# Altium schematic sheet rev_1.SchDoc
size A
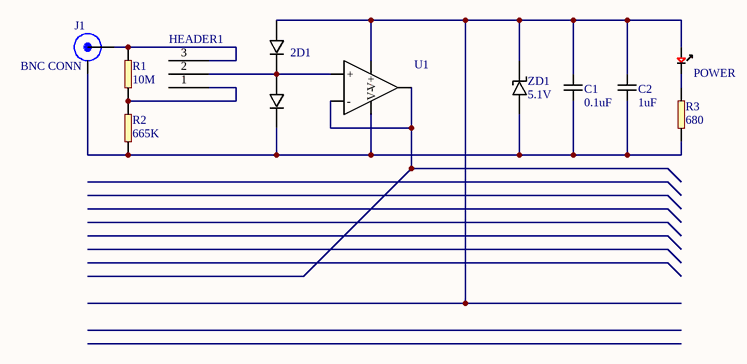
[diagram p0: rev_1.SchDoc]

## Parts
2D1  BAT54SW-FDICT  [SOT-23-3]  (value not drawn)
C1  C: 0.1uF  [0603]  (hidden comment: Capacitor)
C2  C: 1uF  [0603]  (hidden comment: Capacitor)
HEADER1  3x1  [3x1 THRU HOLES 0.1" PITCH]  (value not drawn)
J1  BNC CONN  [BNC THROUGH HOLE]
POWER  LEDR  [0603 - LED]  (value not drawn)
R1  R: 10M  [0603]  (hidden comment: Resistor)
R2  R: 665K  [0603]  (hidden comment: Resistor)
R3  R: 680  [0603]  (hidden comment: Resistor)
U1  MCP6L9IT-E  [SOT-23-5]  (value not drawn)
ZD1  Voltage: 5.1V  (hidden comment: Zener)

## Nets
Net2D1_1: 2D1.1 C1.1 C2.1 POWER.2(A) U1.3(V+) ZD1.1
Net2D1_2: 2D1.2 C1.2 C2.2 J1.1(G) R2.2 R3.2 U1.2(V-) ZD1.2
Net2D1_3: 2D1.3 HEADER1.2 U1.3(+)
NetHEADER1_1: HEADER1.1 R1.2 R2.1
NetHEADER1_3: HEADER1.3 J1.2(S) R1.1
NetPOWER_1: POWER.1(K) R3.1
NetU1_1: U1.1(OUT) U1.4(-)

## Library data of the parts
J1 = A33798
C1 C2 = Capacitor: Supplier 1: Digi-Key; Supplier Part Number 1: 445-9015-6-ND; Supplier Part Number 2: 490-1524-2-ND; Supplier 2: Digi-Key; Supplier 3: Digi-Key; Supplier Part Number 3: 445-1273-1-ND
POWER = LEDR: Supplier 1: Digi-Key; Supplier Part Number 1: 475-2512-1-ND
R1-R3 = Resistor
  R3: Supplier 1: Digi-Key; Supplier Part Number 1: LVK12R020DERDKR-ND; Supplier 2: Digi-Key; Supplier 3: Digi-Key; Supplier Part Number 2: 311-10.0KHRCT-ND; Supplier Part Number 3: 311-100KHRCT-ND; Supplier 4: Digi-Key; Supplier Part Number 4: RHM0.0GCT-ND; Supplier 5: Digi-Key; Supplier 6: Digi-Key; Supplier Part Number 5: 311-200KHRCT-ND; Supplier Part Number 6: LVK12R010DERCT-ND; Supplier 7: Digi-Key; Supplier 8: Digi-Key; Supplier Part Number 7: 311-300KHRCT-ND; Supplier Part Number 8: 311-330GRCT-ND